# Altium schematic sheet Sheet1.SchDoc
size C; SheetNumber: 1; SheetTotal: 1
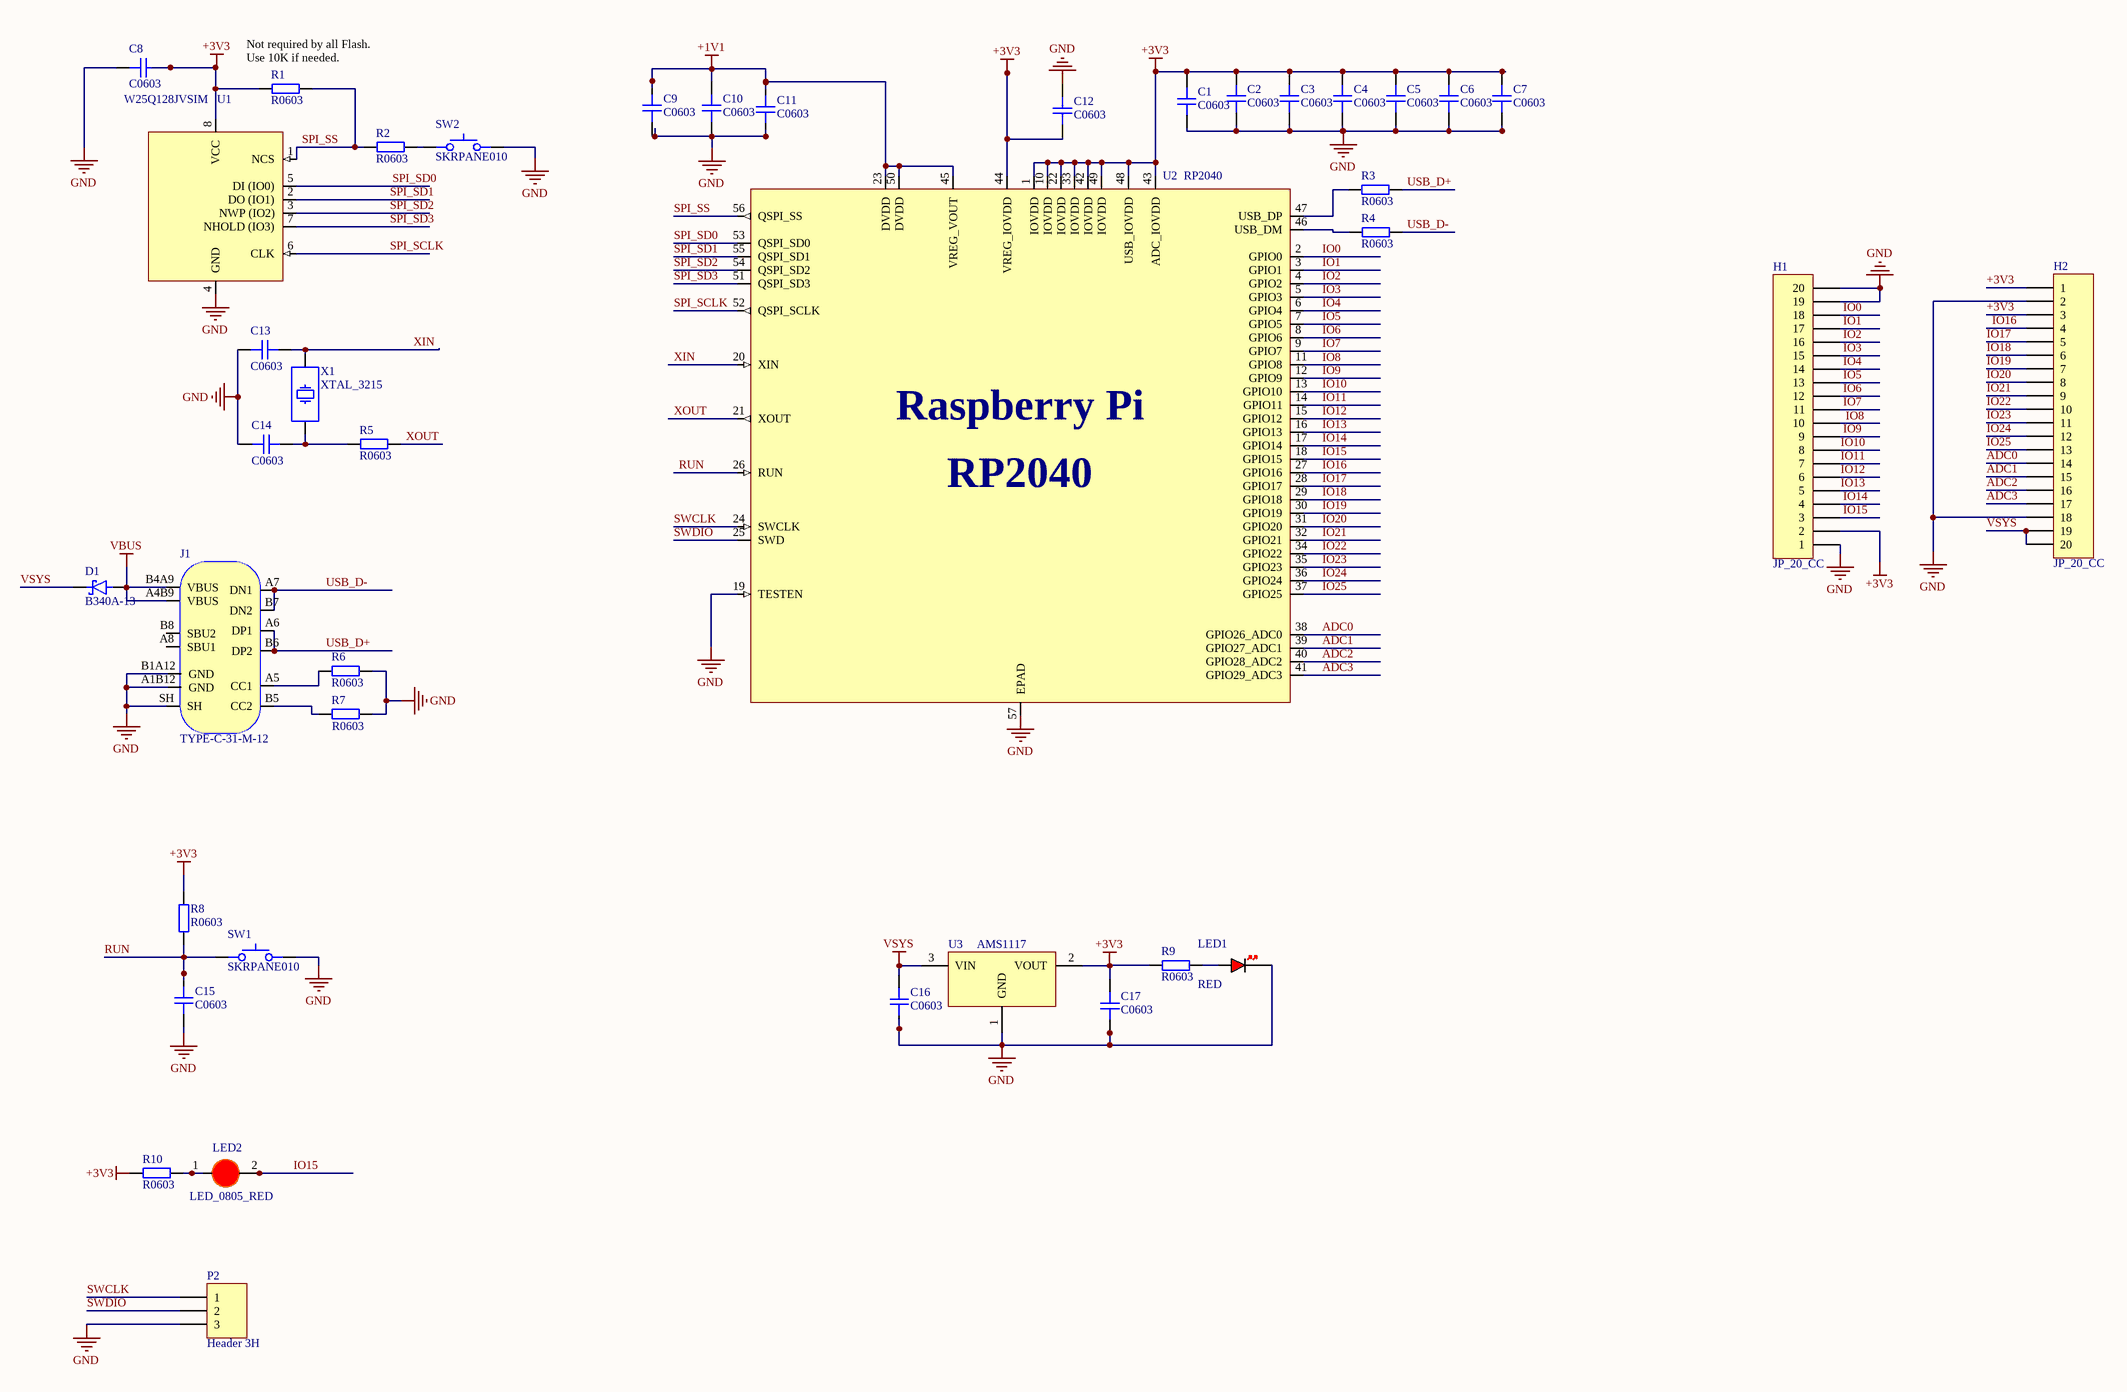
[diagram p0: Sheet1.SchDoc]

## Parts
C1  C0603  [CAP_0603]
C2  C0603  [CAP_0603]
C3  C0603  [CAP_0603]
C4  C0603  [CAP_0603]
C5  C0603  [CAP_0603]
C6  C0603  [CAP_0603]
C7  C0603  [CAP_0603]
C8  C0603  [CAP_0603]
C9  C0603  [CAP_0603]
C10  C0603  [CAP_0603]
C11  C0603  [CAP_0603]
C12  C0603  [CAP_0603]
C13  C0603  [CAP_0603]
C14  C0603  [CAP_0603]
C15  C0603  [CAP_0603]
C16  C0603  [CAP_0603]
C17  C0603  [CAP_0603]
D1  B340A-13  [B340A]
H1  JP_20_CC  [JUMP 1X20 DT]
H2  JP_20_CC  [JUMP 1X20 DT]
J1  TYPE-C-31-M-12  [TYPE-C-31-M-12]
LED1  RED  [LED_0603_RED]
LED2  LED_0805_RED  [LED-0805-Red]
P2  Header 3H  [HDR1X3H]
R1  R0603  [RES_0603]
R2  R0603  [RES_0603]
R3  R0603  [RES_0603]
R4  R0603  [RES_0603]
R5  R0603  [RES_0603]
R6  R0603  [RES_0603]
R7  R0603  [RES_0603]
R8  R0603  [RES_0603]
R9  R0603  [RES_0603]
R10  R0603  [RES_0603]
SW1  SKRPANE010  [SKRPANE010]
SW2  SKRPANE010  [SKRPANE010]
U1  W25Q128JVSIM  [SOIC-8]
U2  RP2040  [QFN-56-EP]
U3  AMS1117  [SOT223 - 3 LEAD]
X1  XTAL_3215  [XTAL_3215-2]

## Nets
+1V1: C9.1 C10.2 C11.2 U2.23(DVDD) U2.45(VREG_VOUT) U2.50(DVDD)
+3V3: C1.1 C2.1 C3.1 C4.1 C5.1 C6.1 C7.1 C8.2 C12.1 C17.2 H1.2 H2.1 H2.3 R1.1 R8.2 R9.1 R10.2 U1.8(VCC) U2.1(IOVDD) U2.10(IOVDD) U2.22(IOVDD) U2.33(IOVDD) U2.42(IOVDD) U2.43(ADC_IOVDD) U2.44(VREG_IOVDD) U2.48(USB_IOVDD) U2.49(IOVDD) U3.2(VOUT)
GND: C1.2 C2.2 C3.2 C4.2 C5.2 C6.2 C7.2 C8.1 C9.2 C10.1 C11.1 C12.2 C13.1 C14.1 C15.1 C16.1 C17.1 H1.1 H1.19 H1.20 H2.2 H2.18 J1.A1B12(GND) J1.B1A12(GND) J1.SH LED1.K P2.3 R6.2 R7.2 SW1.34 SW2.34 U1.4(GND) U2.19(TESTEN) U2.57(EPAD) U3.1(GND)
VBUS: D1.A J1.A4B9(VBUS) J1.B4A9(VBUS)
VSYS: C16.2 D1.C H2.19 H2.20 U3.3(VIN)
ADC0: H2.14 U2.38(GPIO26_ADC0)
ADC1: H2.15 U2.39(GPIO27_ADC1)
ADC2: H2.16 U2.40(GPIO28_ADC2)
ADC3: H2.17 U2.41(GPIO29_ADC3)
IO0: H1.18 U2.2(GPIO0)
IO1: H1.17 U2.3(GPIO1)
IO2: H1.16 U2.4(GPIO2)
IO3: H1.15 U2.5(GPIO3)
IO4: H1.14 U2.6(GPIO4)
IO5: H1.13 U2.7(GPIO5)
IO6: H1.12 U2.8(GPIO6)
IO7: H1.11 U2.9(GPIO7)
IO9: H1.9 U2.12(GPIO9)
IO10: H1.8 U2.13(GPIO10)
IO11: H1.7 U2.14(GPIO11)
IO12: H1.6 U2.15(GPIO12)
IO13: H1.5 U2.16(GPIO13)
IO14: H1.4 U2.17(GPIO14)
IO15: H1.3 LED2.2(K) U2.18(GPIO15)
IO16: H2.4 U2.27(GPIO16)
IO17: H2.5 U2.28(GPIO17)
IO18: H2.6 U2.29(GPIO18)
IO19: H2.7 U2.30(GPIO19)
IO20: H2.8 U2.31(GPIO20)
IO21: H2.9 U2.32(GPIO21)
IO22: H2.10 U2.34(GPIO22)
IO23: H2.11 U2.35(GPIO23)
IO24: H2.12 U2.36(GPIO24)
IO25: H2.13 U2.37(GPIO25)
RUN: C15.2 R8.1 SW1.12 U2.26(RUN)
SPI_SCLK: U1.6(CLK) U2.52(QSPI_SCLK)
SPI_SD0: U1.5(DI_(IO0)) U2.53(QSPI_SD0)
SPI_SD1: U1.2(DO_(IO1)) U2.55(QSPI_SD1)
SPI_SD2: U1.3(NWP_(IO2)) U2.54(QSPI_SD2)
SPI_SD3: U1.7(NHOLD_(IO3)) U2.51(QSPI_SD3)
SPI_SS: R1.2 R2.1 U1.1(NCS) U2.56(QSPI_SS)
SWCLK: P2.1 U2.24(SWCLK)
SWDIO: P2.2 U2.25(SWD)
USB_D+: J1.A6(DP1) J1.B6(DP2) R3.2
USB_D-: J1.A7(DN1) J1.B7(DN2) R4.2
XIN: C13.2 U2.20(XIN) X1.2
XOUT: R5.2 U2.21(XOUT)
NetC14_2: C14.2 R5.1 X1.1
NetJ1_A5: J1.A5(CC1) R6.1
NetJ1_B5: J1.B5(CC2) R7.1
NetLED1_A: LED1.A R9.2
NetLED2_1: LED2.1(A) R10.1
NetR2_2: R2.2 SW2.12
NetR3_1: R3.1 U2.47(USB_DP)
NetR4_1: R4.1 U2.46(USB_DM)

Not connected (* = marked no-connect by the designer): H1 10; J1 A8(SBU1) B8(SBU2); U2 11(GPIO8)

## Notes on the sheet
- (near R1) Not required by all Flash.
  Use 10K if needed.
- Labels drawn without touching a wire or pin: IO8

## Library data of the parts
C1-C17 = CAP_0603: Capacitor SMD 0603; Manufacturer: *; Manufacturer Part Number: *; Distributor Link: *; LCSC: *; Rating: *; Dielectric: *
D1 = B340A-13: Diode Schottky 40 V 3A Surface Mount SMA; MF: Diodes Inc.; Value: *; MP: B340A-13; Package: DO-214 Diodes Inc.; Availability: In Stock; Price: None; SnapEDA_Link: https://www.snapeda.com/parts/B340A-13/Diodes+Inc./view-part/?ref=snap; Check_prices: https://www.snapeda.com/parts/B340A-13/Diodes+Inc./view-part/?ref=eda; Purchase-URL: https://pricing.snapeda.com/search/part/B340A-13/?ref=eda
J1 = TYPE-C-31-M-12: USB Type C Connector Horizontal SMT; Manufacturer: Koren Hroparts; Manufacturer Part Number: TYPE-C-31-M-12
LED1 = LED_0603_RED: LED 0603 RED SMD
R1-R10 = RES_0603: Resistor SMD 0603; Manufacturer: *; Manufacturer Part Number: *; Distributor Link: *; LCSC: *
SW1 SW2 = SKRPANE010: Tactile Switch SMD SPST; Manufacturer: Alps Alpine; Manufacturer Part Number: SKRPANE010
U1 = W25Q128JVSIM: 128M-BIT / SERIAL FLASH MEMORY WITH / DUAL/QUAD SPI & QPI & DTR SOIC-8; Manufacturer: Winbond; Manufacturer Part Number: W25Q128JVSIM
U2 = RP2040: 32-Bit Dual-Core ARM Cortex-M0+ Microcontroller; Manufacturer: Raspberry Pi; Manufacturer Part Number: RP2040
X1 = XTAL_3215: Crystal SMD 3215; Distributor Link: *
P2 = Header 3H: LatestRevisionDate: 17-Jul-2002; LatestRevisionNote: Re-released for DXP Platform.; Publisher: Altium Limited